# Altium schematic sheet Main_Sheet.SchDoc: V1_motor driver
size OrCAD A; ApprovedBy: Abbas Mahmoud; CheckedBy: Abbas Mahmoud; Author: Abbas Mahmoud; CompanyName: lsa 4wya :); DrawnBy: Abbas Mahmoud; Engineer: Abbas Mahmoud; DocumentNumber: 1; Revision: 1; SheetNumber: 1; SheetTotal: 8
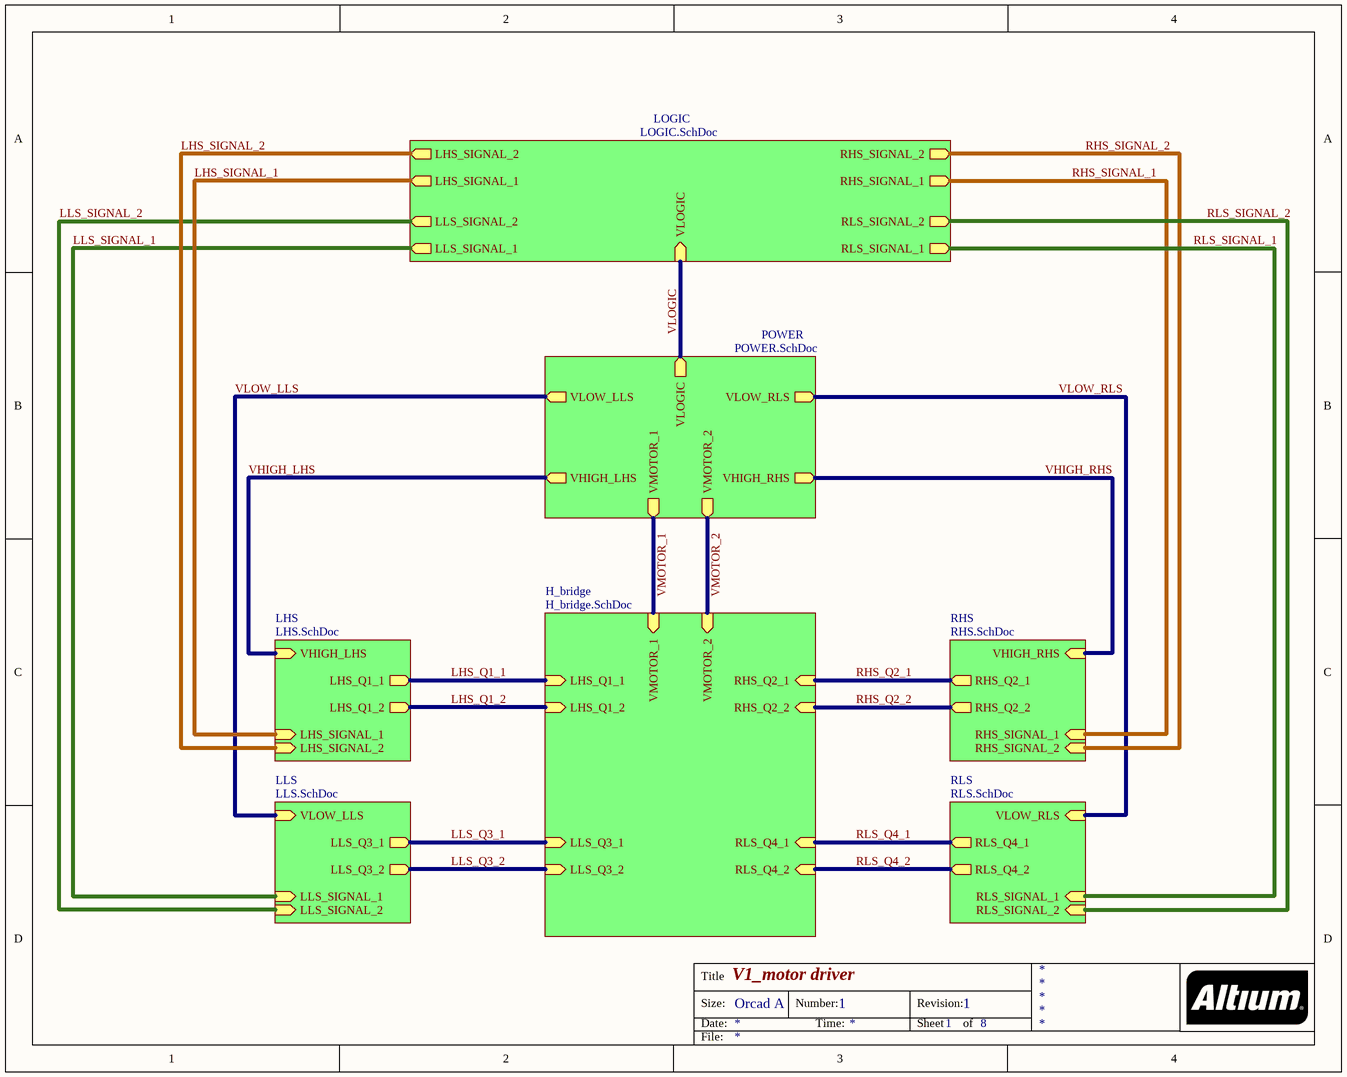
[diagram p0: Main_Sheet.SchDoc]

## Sub-sheets
H_bridge = H_bridge.SchDoc: VMOTOR_1 (in), LHS_Q1_1 (in), LLS_Q3_1 (in), RLS_Q4_1 (in), RHS_Q2_1 (in), RHS_Q2_2 (in), RLS_Q4_2 (in), LLS_Q3_2 (in), LHS_Q1_2 (in), VMOTOR_2 (in)
LHS = LHS.SchDoc: LHS_Q1_1 (out), VHIGH_LHS (in), LHS_SIGNAL_1 (in), LHS_Q1_2 (out), LHS_SIGNAL_2 (in)
LLS = LLS.SchDoc: LLS_Q3_1 (out), VLOW_LLS (in), LLS_SIGNAL_1 (in), LLS_Q3_2 (out), LLS_SIGNAL_2 (in)
LOGIC = LOGIC.SchDoc: VLOGIC (in), RHS_SIGNAL_1 (out), RHS_SIGNAL_2 (out), RLS_SIGNAL_1 (out), RLS_SIGNAL_2 (out), LHS_SIGNAL_1 (out), LHS_SIGNAL_2 (out), LLS_SIGNAL_1 (out), LLS_SIGNAL_2 (out)
POWER = POWER.SchDoc: VMOTOR_1 (out), VHIGH_LHS (out), VLOW_LLS (out), VHIGH_RHS (out), VLOW_RLS (out), VLOGIC (out), VMOTOR_2 (out)
RHS = RHS.SchDoc: RHS_Q2_1 (out), RHS_SIGNAL_1 (in), VHIGH_RHS (in), RHS_Q2_2 (out), RHS_SIGNAL_2 (in)
RLS = RLS.SchDoc: RLS_Q4_1 (out), RLS_SIGNAL_1 (in), VLOW_RLS (in), RLS_Q4_2 (out), RLS_SIGNAL_2 (in)

## Nets
LHS_Q1_1: sheet H_bridge/LHS_Q1_1, sheet LHS/LHS_Q1_1
LHS_Q1_2: sheet H_bridge/LHS_Q1_2, sheet LHS/LHS_Q1_2
LHS_SIGNAL_1: sheet LHS/LHS_SIGNAL_1, sheet LOGIC/LHS_SIGNAL_1
LHS_SIGNAL_2: sheet LHS/LHS_SIGNAL_2, sheet LOGIC/LHS_SIGNAL_2
LLS_Q3_1: sheet H_bridge/LLS_Q3_1, sheet LLS/LLS_Q3_1
LLS_Q3_2: sheet H_bridge/LLS_Q3_2, sheet LLS/LLS_Q3_2
LLS_SIGNAL_1: sheet LLS/LLS_SIGNAL_1, sheet LOGIC/LLS_SIGNAL_1
LLS_SIGNAL_2: sheet LLS/LLS_SIGNAL_2, sheet LOGIC/LLS_SIGNAL_2
RHS_Q2_1: sheet H_bridge/RHS_Q2_1, sheet RHS/RHS_Q2_1
RHS_Q2_2: sheet H_bridge/RHS_Q2_2, sheet RHS/RHS_Q2_2
RHS_SIGNAL_1: sheet RHS/RHS_SIGNAL_1, sheet LOGIC/RHS_SIGNAL_1
RHS_SIGNAL_2: sheet RHS/RHS_SIGNAL_2, sheet LOGIC/RHS_SIGNAL_2
RLS_Q4_1: sheet H_bridge/RLS_Q4_1, sheet RLS/RLS_Q4_1
RLS_Q4_2: sheet H_bridge/RLS_Q4_2, sheet RLS/RLS_Q4_2
RLS_SIGNAL_1: sheet RLS/RLS_SIGNAL_1, sheet LOGIC/RLS_SIGNAL_1
RLS_SIGNAL_2: sheet RLS/RLS_SIGNAL_2, sheet LOGIC/RLS_SIGNAL_2
VHIGH_LHS: sheet LHS/VHIGH_LHS, sheet POWER/VHIGH_LHS
VHIGH_RHS: sheet RHS/VHIGH_RHS, sheet POWER/VHIGH_RHS
VLOGIC: sheet POWER/VLOGIC, sheet LOGIC/VLOGIC
VLOW_LLS: sheet LLS/VLOW_LLS, sheet POWER/VLOW_LLS
VLOW_RLS: sheet RLS/VLOW_RLS, sheet POWER/VLOW_RLS
VMOTOR_1: sheet H_bridge/VMOTOR_1, sheet POWER/VMOTOR_1
VMOTOR_2: sheet H_bridge/VMOTOR_2, sheet POWER/VMOTOR_2

## Notes on the sheet
- Title
- Size:
- Date:
- Orcad A
- Number:
- Time:
- Revision:
- Sheet
- of
- File: